# Altium schematic sheet Card Edge Connector.SchDoc: Card Edge Connector
size 292 x 193 mm; SheetNumber: 2; SheetTotal: 5
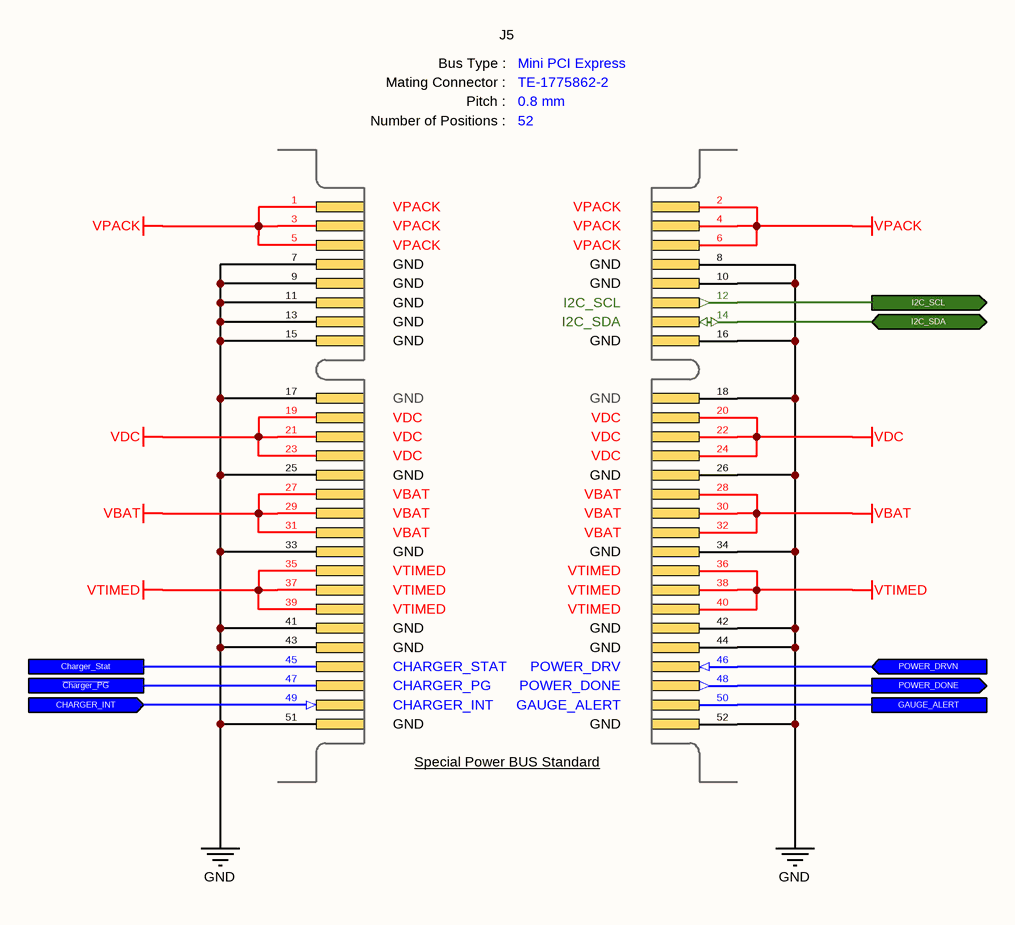
[diagram p0: Card Edge Connector.SchDoc]

## Parts
J5  BUS Type: Mini PCI Express  Mating Connector: TE-1775862-2  Pitch: 0.8 mm  Number of Positions: 52  [PCB - Mini PCI Express]  (hidden comment: Connector - Mini PCI-E [Power])  (no BOM)

## Ports
CHARGER_INT (in), Charger_Stat, GAUGE_ALERT, I2C_SCL (out), I2C_SDA (bidir), POWER_DONE (out), POWER_DRVN (in), ~{Charger_PG}

## Nets
GND: J5.7(Pin-7) J5.8(Pin-8) J5.9(Pin-9) J5.10(Pin-10) J5.11(Pin-11) J5.13(Pin-13) J5.15(Pin-15) J5.16(Pin-16) J5.17(Pin-17) J5.18(Pin-18) J5.25(Pin-25) J5.26(Pin-26) J5.33(Pin-33) J5.34(Pin-34) J5.41(Pin-41) J5.42(Pin-42) J5.43(Pin-43) J5.44(Pin-44) J5.51(Pin-51) J5.52(Pin-52)
VBAT: J5.27(Pin-27) J5.28(Pin-28) J5.29(Pin-29) J5.30(Pin-30) J5.31(Pin-31) J5.32(Pin-32)
VDC: J5.19(Pin-19) J5.20(Pin-20) J5.21(Pin-21) J5.22(Pin-22) J5.23(Pin-23) J5.24(Pin-24)
VPACK: J5.1(Pin-1) J5.2(Pin-2) J5.3(Pin-3) J5.4(Pin-4) J5.5(Pin-5) J5.6(Pin-6)
VTIMED: J5.35(Pin-35) J5.36(Pin-36) J5.37(Pin-37) J5.38(Pin-38) J5.39(Pin-39) J5.40(Pin-40)
~{Charger_PG}: J5.47(Pin-47) ; port ~{Charger_PG}
CHARGER_INT: J5.49(Pin-49) ; port CHARGER_INT
Charger_Stat: J5.45(Pin-45) ; port Charger_Stat
GAUGE_ALERT: J5.50(Pin-50) ; port GAUGE_ALERT
I2C_SCL: J5.12(Pin-12) ; port I2C_SCL
I2C_SDA: J5.14(Pin-14) ; port I2C_SDA
POWER_DONE: J5.48(Pin-48) ; port POWER_DONE
POWER_DRVN: J5.46(Pin-46) ; port POWER_DRVN

## Notes on the sheet
- © 2021 All rights reserved.
  This document may not, in whole or in part, be copied, photocopied, reproduced, translated or converted to any electronic or machine readable from without prior written permission of Mehmet Günce Akkoyun.
  Engineer contact : akkoyun@me.com
- Property of
- Engineer :
- Date :
- Size :
- A4
- Time :
- Project :
- Page :
- /
- Customer :
- Product ID :
- Module ID :
- Version :
- File :
- Revision :
- (in symbol Connector - Mini PCI-E [Power]) Bus Type :; Mating Connector :; Pitch :; Number of Positions :; VPACK; GND; I2C_SCL; I2C_SDA; VDC; VBAT; VTIMED; CHARGER_STAT; POWER_DRV; CHARGER_PG; POWER_DONE; CHARGER_INT; GAUGE_ALERT; Special Power BUS Standard

## Library data of the parts
J5 = Connector - Mini PCI-E [Power]: Mini PCI-Express gold finger connector.; System: Connector